# EAGLE design programmer (EAGLE 6.4)
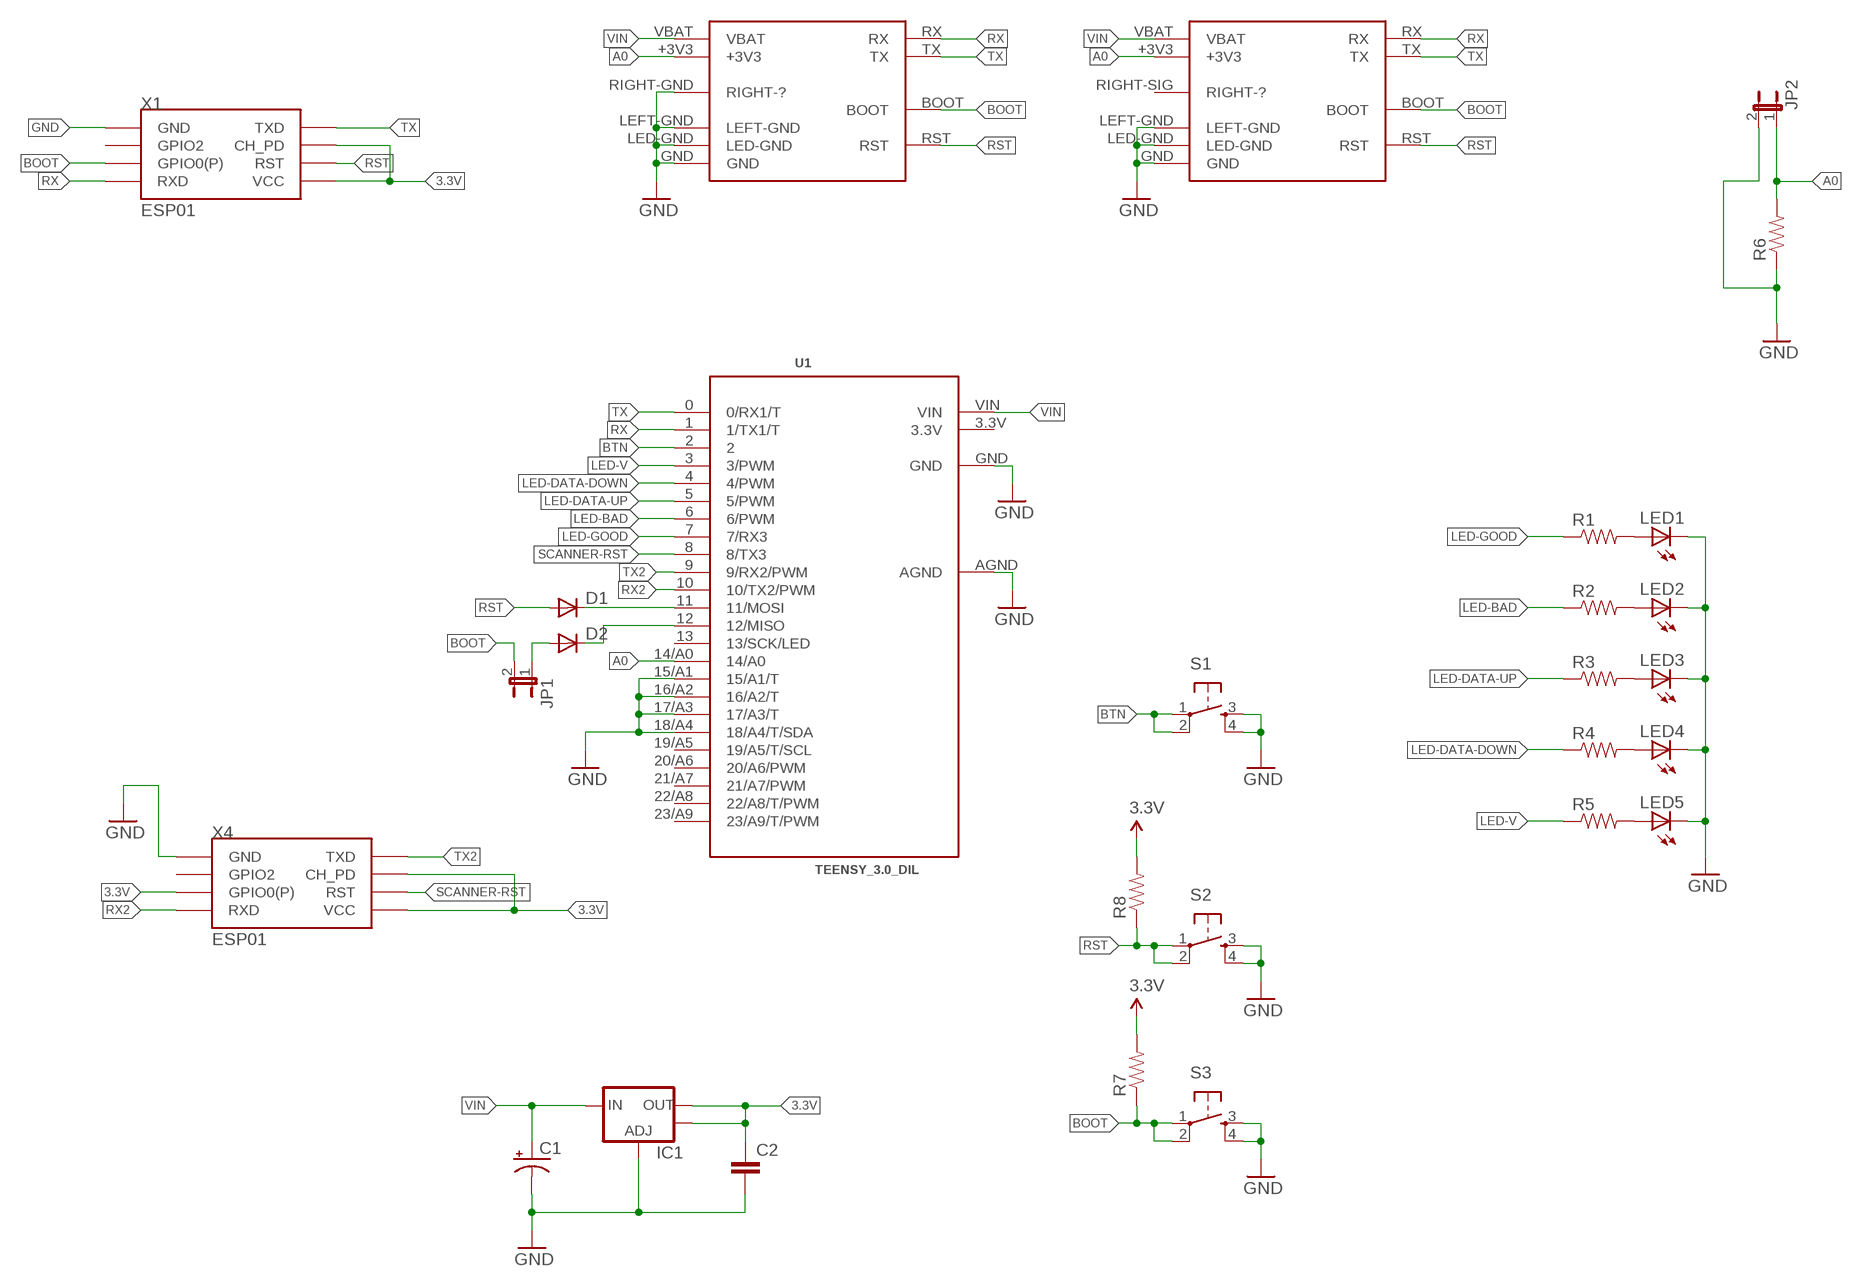
[diagram p0: schematic, sheet 1]

## Parts
C1  CAP_POLPTH1  [CPOL-RADIAL-100UF-25V]
C2  CAPPTH2  [CAP-PTH-SMALL2]
D1  DIODESOD  [SOD-323]
D2  DIODESOD  [SOD-323]
IC1  V_REG_LM1117SOT223  [SOT223]
JP1  JUMPER-2PTH_LOCK  [1X02_LOCK]
JP2  JUMPER-2PTH_LOCK  [1X02_LOCK]
LED1  LED5MM  [LED5MM]
LED2  LED5MM  [LED5MM]
LED3  LED5MM  [LED5MM]
LED4  LED5MM  [LED5MM]
LED5  LED5MM  [LED5MM]
R1  RESISTOR0603-RES  [0603-RES]
R2  RESISTOR0603-RES  [0603-RES]
R3  RESISTOR0603-RES  [0603-RES]
R4  RESISTOR0603-RES  [0603-RES]
R5  RESISTOR0603-RES  [0603-RES]
R6  RESISTOR0603-RES  [0603-RES]
R7  RESISTOR0603-RES  [0603-RES]
R8  RESISTOR0603-RES  [0603-RES]
S1  TAC_SWITCHPTH  [TACTILE-PTH]
S2  TAC_SWITCHPTH  [TACTILE-PTH]
S3  TAC_SWITCHPTH  [TACTILE-PTH]
U1  TEENSY_3.0_DIL  [TEENSY_3.0-3.2&LC_DIL]
X1  ESP01  [ESP01]
X2  DIRTCHEAPRX-PROG-MINI  [DIRTCHEAPRX_MINI_PROGPINS]
X3  DIRTCHEAPRX-PROG-NANO  [DIRTCHEAPRX_NANO_PROGPINS]
X4  ESP01  [ESP01]

## Nets
3.3V: C2.1 IC1.2(OUT) IC1.4(OUT) R7.2 R8.2 X1.CH_PD X1.VCC X4.CH_PD X4.GPIO0(GPIO0(P)) X4.VCC
A0: JP2.1 R6.2 U1.14/A0 X2.+3V3 X3.+3V3
BOOT: JP1.2 R7.1 S3.1 S3.2 X1.GPIO0(GPIO0(P)) X2.BOOT X3.BOOT
BTN: S1.1 S1.2 U1.2
GND: C1.2(-) C2.2 IC1.1(ADJ) JP2.2 LED1.K(C) LED2.K(C) LED3.K(C) LED4.K(C) LED5.K(C) R6.1 S1.3 S1.4 S2.3 S2.4 S3.3 S3.4 U1.15/A1(15/A1/T) U1.16/A2(16/A2/T) U1.17/A3(17/A3/T) U1.18/A4(18/A4/T/SDA) U1.AGND U1.GND X1.GND X2.GND X2.LED-GND X2.LEFT-GND X2.RIGHT-GND(RIGHT-?) X3.GND X3.LED-GND X3.LEFT-GND X4.GND
LED-BAD: R2.1 U1.6(6/PWM)
LED-DATA-DOWN: R4.1 U1.4(4/PWM)
LED-DATA-UP: R3.1 U1.5(5/PWM)
LED-GOOD: R1.1 U1.7(7/RX3)
LED-V: R5.1 U1.3(3/PWM)
N$1: D1.1(C) U1.11(11/MOSI)
N$2: LED1.A R1.2
N$3: LED2.A R2.2
N$4: LED3.A R3.2
N$5: LED4.A R4.2
N$6: LED5.A R5.2
N$7: D2.1(C) U1.12(12/MISO)
N$8: D2.2(A) JP1.1
RST: D1.2(A) R8.1 S2.1 S2.2 X1.RST X2.RST X3.RST
RX: U1.1(1/TX1/T) X1.RX(RXD) X2.RX X3.RX
RX2: U1.10(10/TX2/PWM) X4.RX(RXD)
SCANNER-RST: U1.8(8/TX3) X4.RST
TX: U1.0(0/RX1/T) X1.TX(TXD) X2.TX X3.TX
TX2: U1.9(9/RX2/PWM) X4.TX(TXD)
VIN: C1.1(+) IC1.3(IN) U1.VIN X2.VBAT X3.VBAT
Unconnected: U1.13(13/SCK/LED) U1.19/A5(19/A5/T/SCL) U1.20/A6(20/A6/PWM) U1.21/A7(21/A7/PWM) U1.22/A8(22/A8/T/PWM) U1.23/A9(23/A9/T/PWM) X1.GPIO2 X3.RIGHT-SIG(RIGHT-?) X4.GPIO2

## Power pins joined to a net without a drawn wire
3.3V: U1.3.3V

## Library data of the parts
C1 = dirtcheaprx:CAP_POL: Capacitor Polarized These are standard SMD and PTH capacitors. Normally 10uF, 47uF, and 100uF in electrolytic and tantalum varieties. Always verify the external diameter of the through hole cap, it varies with capacity, voltage, and manufacturer. The EIA devices should be standard.
C2 = dirtcheaprx:CAP: Capacitor Standard 0603 ceramic capacitor, and 0.1" leaded capacitor.
D1 D2 = dirtcheaprx:DIODE: Diode These are standard reverse protection diodes and small signal diodes. SMA package can handle up to about 1A. SOD-323 can handle about 200mA. What the SOD-323 package when ordering, there are some mfgs out there that are 5-pin packages.
IC1 = dirtcheaprx:V_REG_LM1117: Voltage Regulator LM1117 Standard adjustable voltage regulator but in SMD form. Spark Fun Electronics SKU : COM-00595
JP1 JP2 = dirtcheaprx:JUMPER-2: Jumper Basic 0.1" spaced jumper. Use with breakaway headers.
LED1-LED5 = dirtcheaprx:LED: LEDs Standard schematic elements and footprints for 5mm, 3mm, 1206, and 0603 sized LEDs. 5mm - Spark Fun Electronics SKU : COM-00529 (and others)
R1-R8 = dirtcheaprx:RESISTOR: Resistor Basic schematic elements and footprints for 0603, 1206, and PTH resistors.
S1-S3 = dirtcheaprx:TAC_SWITCH: Momentary Switch Button commonly used for reset or general input. Spark Fun Electronics SKU : COM-00097
U1 = dirtcheaprx:TEENSY_3.0_DIL: TEENSY 3.0 in a classic breadboard layout - pins between the two outer rows.
X1 X4 = dirtcheaprx:ESP01: ESP8266 Wifi module 01
X2 X3 = dirtcheaprx:DIRTCHEAPRX-PROG

## Board
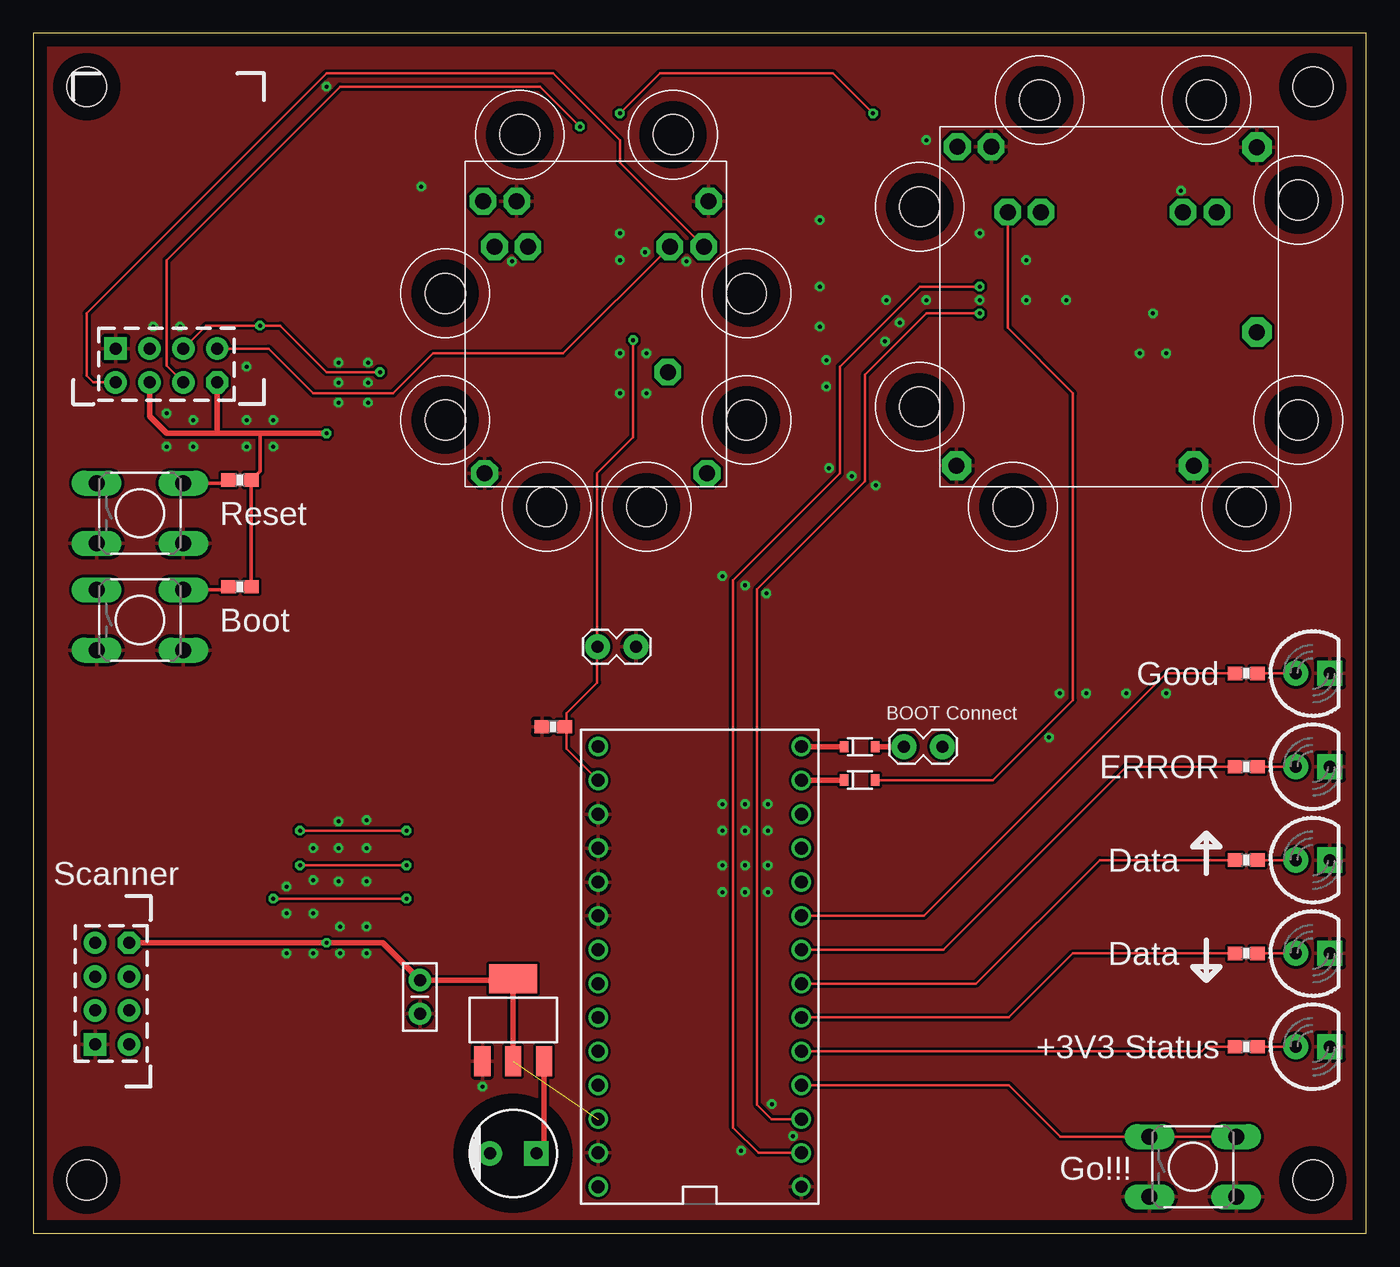
[diagram p1: board, top side]
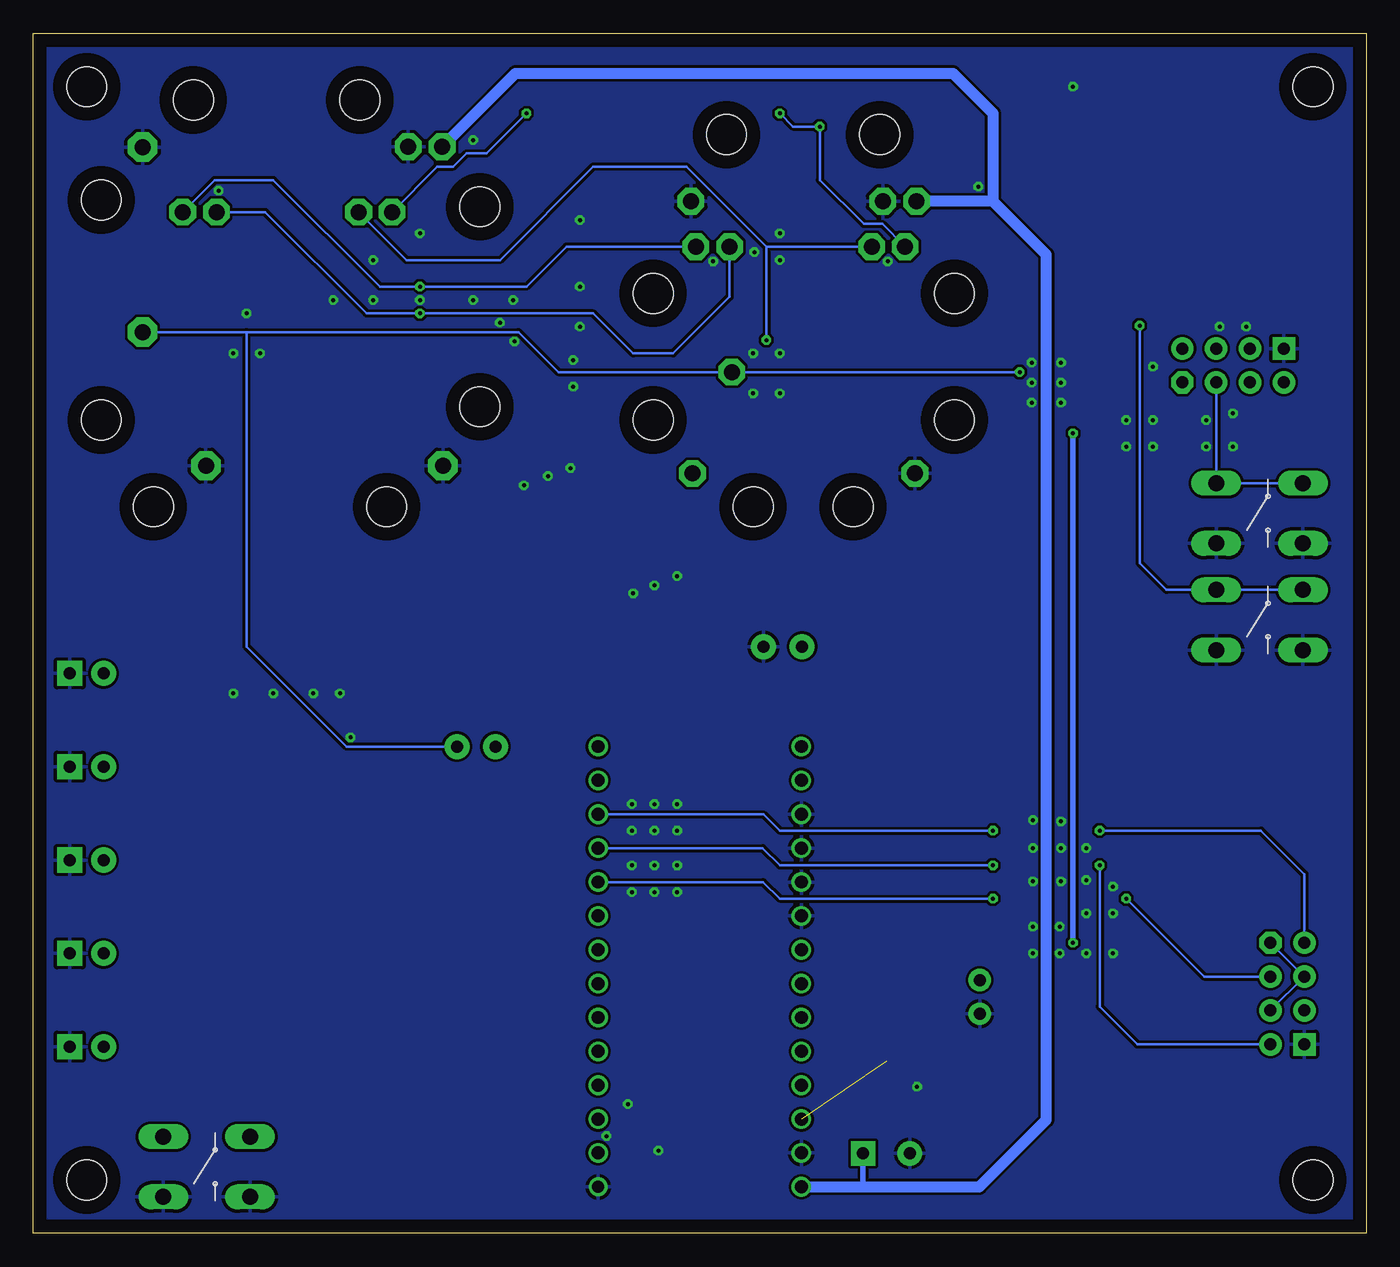
[diagram p2: board, bottom side, seen from below]

Size 100 x 90 mm. Coordinates in mm from the lower left corner, seen from the top.
Outline: 0,0 100,0 100,90 0,90 0,0
Copper layers (1*16): Top 0.035mm / dielectric 1.5mm / Bottom 0.035mm
Design rules "default": minimum track width 10mil, minimum drill 24mil, track to track 8mil, track to pad 8mil, pad to pad 8mil, via to via 8mil, smd to smd 8mil, copper to edge 40mil, drill to drill 8mil, minimum pad ring 10mil, minimum via ring 8mil, stop-mask expansion 4mil, vias tented up to drill 0mil, thermal gap 10mil
Holes 3 mm at 4,4 96,4 96,86 4,86

### Footprints (pad centres in the part's own frame; a part is rotated, then mirrored left to right if it is on the bottom)
CPOL-RADIAL-100UF-25V = drill 0.9 pad 1.829 square: 1 1.75,0 | drill 0.9 pad 1.829: 2 -1.75,0
CAP-PTH-SMALL2 = drill 0.9 pad 1.651: 1 0,0; 2 2.54,0
SOD-323 = smd 0.63 x 0.83: 1 -1.15,0; 2 1.15,0
SOT223 = smd 1.219 x 2.235: 1 -2.311,-3.099; 2 0,-3.099; 3 2.311,-3.099 | smd 3.6 x 2.2: 4 0,3.099
1X02_LOCK = drill 0.9 pad 1.88: 1 -0.178,0; 2 2.718,0
LED5MM = drill 0.9 pad 1.88: A -1.27,0 | drill 0.9 pad 1.88 square: K 1.27,0
0603-RES = smd 1.1 x 1: 1 -0.85,0; 2 0.85,0
TACTILE-PTH = drill 1.2 pad 1.88 long: 1 -3.251,2.261; 2 3.251,2.261; 3 -3.251,-2.261; 4 3.251,-2.261
TEENSY_3.0-3.2&LC_DIL = drill 0.965: 0 -7.62,13.97; 1 -7.62,11.43; 2 -7.62,8.89; 3 -7.62,6.35; 3.3V 7.62,11.43; 4 -7.62,3.81; 5 -7.62,1.27; 6 -7.62,-1.27; 7 -7.62,-3.81; 8 -7.62,-6.35; 9 -7.62,-8.89; 10 -7.62,-11.43; 11 -7.62,-13.97; 12 -7.62,-16.51; 13 7.62,-16.51; 14/A0 7.62,-13.97; 15/A1 7.62,-11.43; 16/A2 7.62,-8.89; 17/A3 7.62,-6.35; 18/A4 7.62,-3.81; 19/A5 7.62,-1.27; 20/A6 7.62,1.27; 21/A7 7.62,3.81; 22/A8 7.62,6.35; 23/A9 7.62,8.89; AGND 7.62,13.97; VIN 7.62,16.51 | drill 0.9: GND -7.62,16.51
ESP01 = drill 0.9 pad 1.676: CH_PD -1.285,-8.178; GPIO0 1.255,-5.638; GPIO2 -1.285,-5.638; RST 1.255,-8.178; RX 3.795,-5.638; TX -3.825,-8.178 | drill 0.9 pad 1.676 square: GND -3.825,-5.638 | drill 0.9 pad 1.676 octagon: VCC 3.795,-8.178
DIRTCHEAPRX_MINI_PROGPINS = drill 1.2 pad 2 octagon: +3V3 7.6,20.6; GND 3.87,25.5; RST 5.1,20.6; RX 18.26,20.6; TX 20.8,20.6; VBAT 1.33,25.5 | drill 1.2 pad 2.2 octagon: BOOT 23.8,11.6; LED-GND 23.8,25.47; LEFT-GND 1.27,1.57; RIGHT-GND 19.05,1.57 | hole 3: -1.5,21; 7.5,29; 20,29; 26.9,21.5; -1.5,6; 5.5,-1.5; 23,-1.5; 26.9,5
DIRTCHEAPRX_NANO_PROGPINS = drill 1.2 pad 2 octagon: +3V3 14.9,18; BOOT 4.4,8.6; GND 15.73,21.4; LED-GND 1.33,21.4; LEFT-GND 18.14,1; RIGHT-SIG 1.46,1; RST 17.4,18; RX 4.24,18; TX 1.7,18; VBAT 18.27,21.4 | hole 3: 6,-1.5; 13.5,-1.5; -1.5,5; 21.1,5; -1.5,14.5; 21.1,14.5; 15.5,26.4; 4,26.4

### Placement (x,y rotation side)
C1  36,6 0 top
C2  29,19 270 top
D1  62,34 0 top
D2  62,36.5 0 top
IC1  36,16 0 top
JP1  65.5,36.5 0 top
JP2  42.5,44 0 top
LED1  96,42 0 top
LED2  96,35 0 top
LED3  96,28 0 top
LED4  96,21 0 top
LED5  96,14 0 top
R1  91,42 0 top
R2  91,35 0 top
R3  91,28 0 top
R4  91,21 0 top
R5  91,14 0 top
R6  39,38 0 top
R7  15.5,48.5 0 top
R8  15.5,56.5 0 top
S1  87,5 0 top
S2  8,54 0 top
S3  8,46 0 top
U1  50,20 180 top
X1  10,72 0 top
X2  68,56 0 top
X3  52,56 0 bottom
X4  -1,18 90 top

### Tracks (layer width: path | path; a pad name or v marks a point on that pad's centre or on a via)
3.3V  (via drill 0.3)  (1 unrouted)
  Top 0.254: R7.2 R8.2 17,57.15 17,60
  Top 0.406: 13.79,60 X1.VCC | X1.CH_PD 8.71,61.28 10,60 13.79,60 | 13.79,60 17,60 v22,60 | X4.VCC v22,21.8 26.2,21.8 C2.1 36,19 IC1.4 IC1.2
  Bottom 0.203: X4.VCC X4.GPIO0 X4.CH_PD
  Bottom 0.406: v22,60 v22,21.8
A0  (via drill 0.3)
  Top 0.203: v45,67 45,59.7 42.3,57 42.3,44 | U1.14/A0 40,36.35 40,38 | 40,38 40,39 42.3,41.3 42.3,44 | 40,38 R6.2 | 42.3,44 JP2.1
  Bottom 0.203: X3.+3V3 45,74 | 45,74 51,80 58,80 65,73 72,73 X2.+3V3 | 45,74 v45,67
BOOT  (via drill 0.3)
  Top 0.203: v26,64.6 22,64.6 18.52,68.08 v17,68.08 12.97,68.08 X1.GPIO0
  Top 0.254: R7.1 14.65,48.26 S3.2
  Bottom 0.203: X2.BOOT 84,67.6 | 84,67.6 63.6,67.6 60.6,64.6 X3.BOOT v26,64.6 | 84,67.6 84,44 76.5,36.5 JP1.2 | S3.1 S3.2 14.99,48.26 17,50.27 v17,68.08
BTN
  Top 0.203: S1.2 S1.1 77.04,7.26 73.19,11.11 U1.2
GND  (via drill 0.3)
  other vias: 59,71 49,72.9 45.9,73.6 71,70 86.1,78.2 85,66 83,66 46,63 44,63 44,66 46,66 11,68 9,68 16,65 12,61 67,82 84,69 35.9,72.9 29.1,78.5 22.9,63.8 25.1,63.8 44,73 44,75 67,70 64,70 59,68 59,76 22.9,62.3 25.1,62.3 22.9,65.3 25.1,65.3 57,7.3 55.4,9.7 53.1,6.2 53.4,25.6 53.4,27.6 53.4,30.2 53.4,32.2 51.7,32.2 51.7,30.2 51.7,27.6 51.7,25.6 55.1,25.6 55.1,27.6 55.1,32.2 55.1,30.2 22,86 65,68.3 63.9,66.9 61.4,56.8 53.4,48.6 55,48 59.7,57.4 63.2,56.1 51.7,49.3 23,23 25,23 25,21 23,21 22.9,26.4 22.9,28.9 22.9,30.9 25,31 25,28.9 25,26.4 21,26.5 21,28.9 21,24 19,24 19,26 19,21 21,21 33.7,11 16,61 18,61 18,59 16,59 12,59 10,59 10,61.5 77,40.5 79,40.5 76.2,37.2 82,40.5 85,40.5 74.5,70 77.5,70 74.5,73 71,75 59.5,65.5 59.5,63.5
  pour Bottom (isolate 0.203): 0,0 100,0 100,90 0,90
  pour Top (isolate 0.203): 0,0 100,0 100,90 0,90
LED-BAD
  Top 0.203: U1.6 68.27,21.27 82,35 R2.1
LED-DATA-DOWN
  Top 0.203: U1.4 73.19,16.19 78,21 R4.1
LED-DATA-UP
  Top 0.203: U1.5 70.73,18.73 80,28 R3.1
LED-GOOD
  Top 0.203: U1.7 66.81,23.81 85,42 R1.1
LED-V
  Top 0.203: U1.3 87.65,13.65 88,14 R5.1
N$1
  Top 0.203: 60.85,33.97 D1.1
  Top 0.406: U1.11 60.85,33.97
N$2
  Top 0.203: R1.2 LED1.A
N$3
  Top 0.203: R2.2 LED2.A
N$4
  Top 0.203: R3.2 LED3.A
N$5
  Top 0.203: R4.2 LED4.A
N$6
  Top 0.203: R5.2 LED5.A
N$7
  Top 0.203: D2.1
  Top 0.406: U1.12 D2.1
N$8
  Top 0.406: D2.2 JP1.1
RST  (via drill 0.3)
  Top 0.203: X1.RST 10,65.08 10,73 23,86 38,86 v41,83 | v63,84 60,87 47,87 v44,84 | X2.RST 73.1,67.9 78,63 78,40 72,34 D1.2
  Top 0.254: v11.26,56.26 14.65,56.26 R8.1
  Bottom 0.203: X3.RST 36.3,75.7 37.7,75.7 41,79 v41,83 43,83 v44,84 | X2.RST 69.7,80 68.5,80 67.5,81 66,81 v63,84 | X1.RST v11.26,56.26 S2.2 S2.1
RX  (via drill 0.3)
  Top 0.203: U1.1 55.39,8.57 54.3,9.66 54.3,48.3 62.4,56.4 62.4,64.4 67,69 v71,69 | X1.RX 17.64,66.36 21,63 27,63 30,66 39.76,66 X3.RX
  Bottom 0.203: X2.RX 82.6,76.6 75,69 v71,69 58,69 55,66 52,66 47.76,70.24 X3.RX
RX2  (via drill 0.3)
  Top 0.203: v28,30.2 v20,30.2
  Bottom 0.203: U1.10 45.23,31.43 44,30.2 v28,30.2 | v20,30.2 7.9,30.2 4.64,26.94 X4.RX
SCANNER-RST  (via drill 0.3)
  Top 0.203: v28,25.1 v18,25.1
  Bottom 0.203: U1.8 45.25,26.35 44,25.1 v28,25.1 | v18,25.1 12.15,19.25 X4.RST
TX  (via drill 0.3)
  Top 0.203: U1.0 54.39,6.03 52.5,7.92 52.5,49 60.5,57 60.5,65 66.5,71 v71,71 | X1.TX 4.5,63.82 4,64.32 4,69 22,87 39,87 44,82 44,80.3 X3.TX
  Bottom 0.203: X2.TX 86.4,79 82,79 74,71 v71,71 63,71 60,74 X3.TX
TX2  (via drill 0.3)
  Top 0.203: v28,27.6 v20,27.6
  Bottom 0.203: U1.9 45.29,28.89 44,27.6 v28,27.6 | v20,27.6 20,17 17.18,14.18 X4.TX
VIN
  Top 0.406: C1.1 38.31,6 IC1.3
  Bottom 0.406: C1.1 37.75,3.49 39,3.49
  Bottom 0.813: U1.VIN 39,3.49 29.02,3.49 24,8.51 24,73.4 28,77.4 | 28,77.4 X3.VBAT | X2.VBAT 63.83,87 31,87 28,84 28,77.4

### Text on the board
tPlace: Reset | Boot | Good | BOOT Connect | ERROR | Data | Scanner | Data | +3V3 Status | Go!!!